# Altium schematic sheet DCTCXO.SchDoc: DCTCXO
size B; SheetNumber: 8; SheetTotal: 9
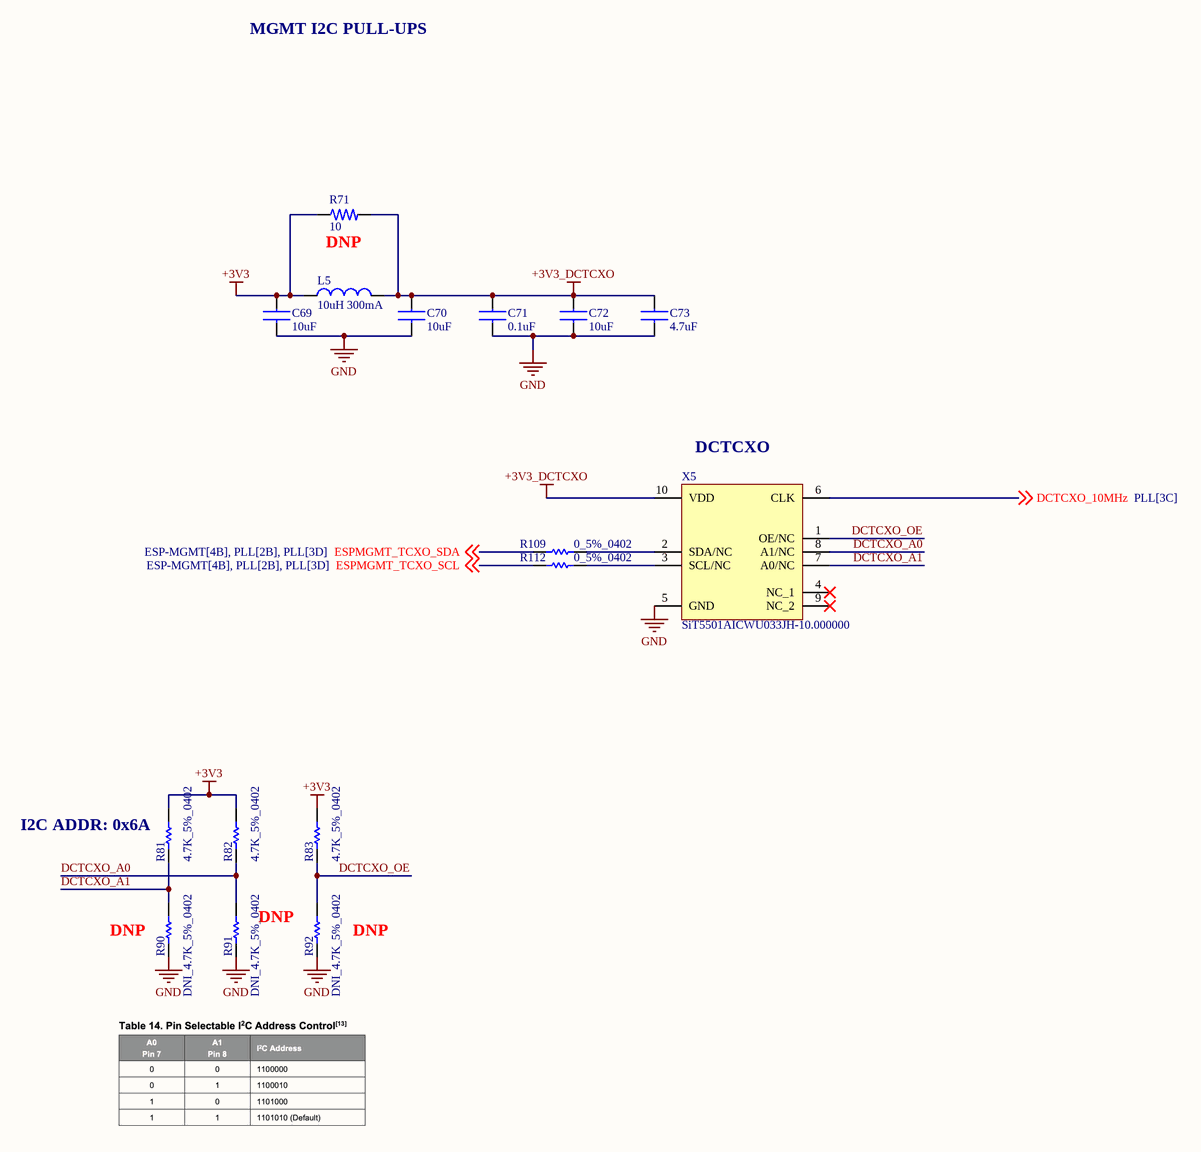
[diagram p0: DCTCXO.SchDoc]

## Parts
C69  10uF  [CAP_0402]
C70  10uF  [CAP_0402]
C71  0.1uF  [CAP_0402]
C72  10uF  [CAP_0402]
C73  4.7uF  [CAP_0402]
L5  10uH 300mA  [L_490-LQM18DN100M70LCT-ND]
R71  10  [RES_0402]  (no BOM)
R81  4.7K_5%_0402  [RESC1005X40X25LL05T05]
R82  4.7K_5%_0402  [RESC1005X40X25LL05T05]
R83  4.7K_5%_0402  [RESC1005X40X25LL05T05]
R90  DNI_4.7K_5%_0402  [RESC1005X40X25LL05T05]  (no BOM)
R91  DNI_4.7K_5%_0402  [RESC1005X40X25LL05T05]  (no BOM)
R92  DNI_4.7K_5%_0402  [RESC1005X40X25LL05T05]  (no BOM)
R109  0_5%_0402  [RESC1005X40X25ML05T10]
R112  0_5%_0402  [RESC1005X40X25ML05T10]
X5  SiT5501AICWU033JH-10.000000  [XTAL_SiT5501_70x50]

## Nets
+3V3: C69.2 L5.1 R71.1 R81.2 R82.2 R83.2
+3V3_DCTCXO: C70.2 C71.2 C72.2 C73.2 L5.2 R71.2 X5.10(VDD)
GND: C69.1 C70.1 C71.1 C72.1 C73.1 R90.1 R91.1 R92.1 X5.5(GND)
DCTCXO_10MHz: X5.6(CLK) ; off-sheet DCTCXO_10MHz
DCTCXO_A0: R82.1 R91.2 X5.8(A1/NC)
DCTCXO_A1: R81.1 R90.2 X5.7(A0/NC)
DCTCXO_OE: R83.1 R92.2 X5.1(OE/NC)
ESPMGMT_TCXO_SCL: R112.1 ; off-sheet ESPMGMT_TCXO_SCL
ESPMGMT_TCXO_SDA: R109.1 ; off-sheet ESPMGMT_TCXO_SDA
NetR109_2: R109.2 X5.2(SDA/NC)
NetR112_2: R112.2 X5.3(SCL/NC)

Not connected (* = marked no-connect by the designer): X5 4(NC_1)* 9(NC_2)*

## Notes on the sheet
- MGMT I2C PULL-UPS
- (near R71) DNP
- (near X5) DCTCXO
- (near R81) I2C ADDR: 0x6A
- (near R90) DNP
- DNP
- (near R92) DNP

## Library data of the parts
C69 C70 C72 = CAP_CL05A106MQ5NUNC: Cap Ceramic 10uF 6.3V X5R 20% SMD 0402 85°C Paper T/R; Manufacturer: Samsung; Supplier 1: Digi-Key; Manufacturer Part Number: CL05A106MQ5NUNC; RoHS: Yes; Category: Ceramic Capacitors; Stock 1: 3345553; Pricing 1: 1=0.27000, 10=0.18400, 50=0.11020, 100=0.09300, 500=0.06362, 1000=0.05629, 2500=0.05384, 5000=0.04894 (USD); Mount: Surface Mount; Case/Package: 0402; Case Code (Metric): 1005; Case Code (Imperial): 0402; Min Operating Temperature: -55°C; Max Operating Temperature: 85°C; Tolerance: 20%; Capacitance: 10uF; Dielectric: X5R; Packaging: Tape and Reel; Package Quantity: 1; Voltage Rating: 6.3V; Series: CL; Construction: Flat; Length: 1mm; Width: 0.02inch; Height: 0.5mm; Thickness: 0.028inch; Depth: 0.5mm; Radiation Hardening: No; ComponentLink1URL: https://datasheet.ciiva.com/16437/cl05a106mq5nunc-16437356.pdf?src-supplier=Future+Electronics; ComponentLink1Description: https://datasheet.ciiva.com/16437/cl05a106mq5nunc-16437356.pdf?src-supplier=Future+Electronics; ComponentLink2URL: https://datasheet.ciiva.com/26877/getdatasheetpartid-355289-26877841.pdf?src-supplier=Verical; ComponentLink2Description: https://datasheet.ciiva.com/26877/getdatasheetpartid-355289-26877841.pdf?src-supplier=Verical; Supplier Part Number 1: 1276-1451-1-ND
C71 = CAP_GCM155R71C104KA55J: Cap Ceramic 0.1uF 16V X7R 10% SMD 0402 125C Paper T/R; Manufacturer: Murata; Capacitance: 100nF; Supplier 1: Digi-Key; Manufacturer Part Number: GCM155R71C104KA55J; RoHS: Yes; Category: Ceramic Capacitors; Stock 1: 10738061; Pricing 1: 1=0.10000, 10=0.03500, 50=0.01920, 100=0.01560, 500=0.01116, 1000=0.00877, 2500=0.00798, 5000=0.00734 (USD); Mount: Surface Mount; Case/Package: 0402; Case Code (Imperial): 0402; Case Code (Metric): 1005; Min Operating Temperature: -55°C; Max Operating Temperature: 125°C; Tolerance: 10%; Voltage Rating: 16V; Voltage Rating (DC): 16V; Packaging: Tape and Reel; Package Quantity: 1; Dielectric: X7R; Termination: SMD/SMT; Series: GCM; Construction: Flat; Length: 1mm; Width: 0.5mm; Height: 0.5mm; Thickness: 0.022inch; Depth: 0.5mm; Ratings: AEC-Q200; Radiation Hardening: No; Lead Free: Lead Free; ComponentLink1URL: https://datasheet.ciiva.com/11618/product-11618848.pdf?src-supplier=Avnet; ComponentLink1Description: https://datasheet.ciiva.com/11618/product-11618848.pdf?src-supplier=Avnet; ComponentLink2URL: https://datasheet.ciiva.com/16440/gcm155r71c104ka55j-16440393.pdf?src-supplier=Future+Electronics; ComponentLink2Description: https://datasheet.ciiva.com/16440/gcm155r71c104ka55j-16440393.pdf?src-supplier=Future+Electronics; ComponentLink3URL: https://datasheet.ciiva.com/29542/product-29542474.pdf?src-supplier=Digi-Key; ComponentLink3Description: https://datasheet.ciiva.com/29542/product-29542474.pdf?src-supplier=Digi-Key; ComponentLink4URL: https://datasheet.ciiva.com/29542/product-29542475.pdf?src-supplier=Digi-Key; ComponentLink4Description: https://datasheet.ciiva.com/29542/product-29542475.pdf?src-supplier=Digi-Key; Supplier Part Number 1: 490-7998-1-ND
C73 = CAP_LMK105BBJ475MVLF: Multilayer Ceramic Capacitors MLCC - SMD/SMT 4.7uF 10V X5R +/-20% 0402 Gen Purp; Manufacturer: Taiyo Yuden; Tolerance: 20%; Supplier 1: Digi-Key; Manufacturer Part Number: LMK105BBJ475MVLF; RoHS: Yes; Category: Ceramic Capacitors; Pricing 1: 1=0.21000, 10=0.14400, 50=0.08640, 100=0.07300, 500=0.04994, 1000=0.04417, 2500=0.04225, 5000=0.03841 (USD); Mount: Surface Mount; Case/Package: 0402; Case Code (Metric): 1005; Case Code (Imperial): 0402; Weight: 2.3E-05oz; Min Operating Temperature: -55°C; Max Operating Temperature: 85°C; Capacitance: 4.7uF; Package Quantity: 10000; Packaging: Tape and Reel; Voltage Rating: 10V; Voltage Rating (DC): 10V; Dielectric: X5R; Termination: SMD/SMT; Resistor Type: Ceramic; Length: 1mm; Width: 0.02inch; Height: 0.5mm; Thickness: 0.022inch; Halogen Free: Halogen Free; RoHS Compliant: Yes; ComponentLink1URL: https://datasheet.ciiva.com/24462/423lmk105bbj475mvlf-24462535.pdf?src-supplier=Onlinecomponents.com; ComponentLink1Description: https://datasheet.ciiva.com/24462/423lmk105bbj475mvlf-24462535.pdf?src-supplier=Onlinecomponents.com; ComponentLink2URL: https://datasheet.ciiva.com/18697/mlcc-all-e-18697686.pdf?src-supplier=Digi-Key; ComponentLink2Description: https://datasheet.ciiva.com/18697/mlcc-all-e-18697686.pdf?src-supplier=Digi-Key; ComponentLink3URL: https://datasheet.ciiva.com/18697/mlcc-all-e-18697685.pdf?src-supplier=Digi-Key; ComponentLink3Description: https://datasheet.ciiva.com/18697/mlcc-all-e-18697685.pdf?src-supplier=Digi-Key; Supplier Part Number 1: 587-3408-1-ND
L5 = L_LQM18DN100M70L: Inductor, 10Uh, 0.3A, Multilayer Rohs Compliant: Yes; Manufacturer: Murata; Supplier 1: Digi-Key; Manufacturer Part Number: LQM18DN100M70L; RoHS: Yes; Category: Fixed Inductors; Stock 1: 236207; Pricing 1: 1=0.12000, 10=0.10500, 25=0.09280, 50=0.07900, 100=0.06970, 250=0.06388, 500=0.05808, 1000=0.04878 (USD); Supplier Part Number 1: 490-LQM18DN100M70LCT-ND
R71 = RES_RC0402FR-0710RL: Res General Purpose Thick Film 0402 10 Ohm 1% 1/16W ±200ppm/°C Molded SMD Paper T/R; Manufacturer: Yageo; Power Rating: 62.5mW; Voltage Rating: 50V; Value: 10R; Max Power Dissipation: 63mW; Supplier 1: Digi-Key; Manufacturer Part Number: RC0402FR-0710RL; RoHS: Yes; Category: Chip SMD Resistors; Stock 1: 6576941; Pricing 1: 1=0.10000, 10=0.02200, 100=0.00880, 1000=0.00396, 2500=0.00344, 5000=0.00284 (USD); Case/Package: 0402; Case Code (Imperial): 0402; Case Code (Metric): 1005; Min Operating Temperature: -55°C; Max Operating Temperature: 155°C; Tolerance: 1%; Packaging: Tape and Reel; Termination: SMD/SMT; Resistor Type: Thick Film; Temperature Coefficient: 200ppm/°C; Number of Terminations: 2; Features: Moisture Resistant; Series: RC; Resistance Tolerance: 1%; Technology: THICK FILM; Construction: Rectangular; Working Voltage: 50V; Length: 1mm; Height: 0.32mm; Depth: 0.5mm; Military Standard: Not; Lead Free: Lead Free; RoHS Compliant: Yes; Reach SVHC Compliant: Yes; ComponentLink1URL: https://datasheet.ciiva.com/46394/1018594-46394954.pdf?src-supplier=Element14; ComponentLink1Description: https://datasheet.ciiva.com/46394/1018594-46394954.pdf?src-supplier=Element14; ComponentLink2URL: https://datasheet.ciiva.com/7849/1018594-7849818.pdf?src-supplier=Element14; ComponentLink2Description: https://datasheet.ciiva.com/7849/1018594-7849818.pdf?src-supplier=Element14; ComponentLink3URL: https://datasheet.ciiva.com/7849/1018594-7849819.pdf?src-supplier=Element14; ComponentLink3Description: https://datasheet.ciiva.com/7849/1018594-7849819.pdf?src-supplier=Element14; ComponentLink4URL: https://datasheet.ciiva.com/15189/getdatasheetpartid-323697-15189339.pdf?src-supplier=Verical; ComponentLink4Description: https://datasheet.ciiva.com/15189/getdatasheetpartid-323697-15189339.pdf?src-supplier=Verical; Supplier Part Number 1: 311-10.0LRCT-ND
R81-R83 R90-R92 = CMP-1011-00090-2: Part Number: CRCW04024K70JNTD; Manufacturer: Vishay Dale
R109 R112 = CMP-2002-06457-1: Manufacturer: Panasonic; Part Number: ERJ-U020R00X
X5 = XTAL_SIT5501AI-WUG33JT-10.000000: 1 MHz  60 MHz, Elite X Stratum 3E Precision Oscillator; Manufacturer_Name: SiTime; Manufacturer_Part_Number: SiT5501AI-WU033JH-10.000000; Geometry.Height: 2.2mm; Mouser Part Number: *; Mouser Price/Stock: *; Arrow Part Number: *; Arrow Price/Stock: *; Mouser Testing Part Number: *; Mouser Testing Price/Stock: *; Datasheet Link: https://www.sitime.com/support/resource-library/datasheets/sit5501-datasheet